# Altium schematic sheet 1S锂电池保护.SchDoc
size A4; SheetNumber: 4; SheetTotal: 7
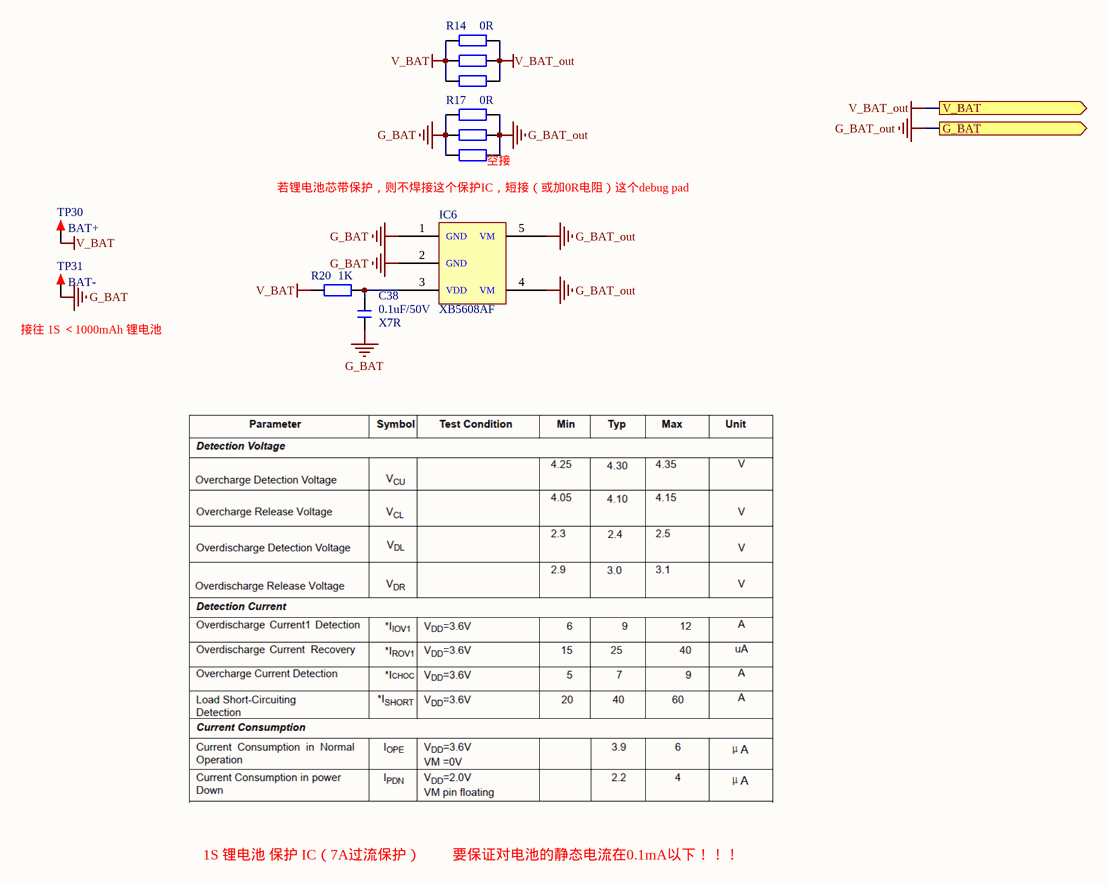
[diagram p0: 1S锂电池保护.SchDoc]

## Parts
C38  0.1uF/50V  BOM名称: X7R  [C 0402_L]
IC6  XB5608AF  [SOT23-5N]
R14  0R  [R 0402_L]
R15  0R  [R 0402_L]  (value not drawn)
R16  0R  [R 0402_L]  (value not drawn)
R17  0R  [R 0402_L]
R18  0R  [R 0402_L]  (value not drawn)
R19  0R  [R 0402_L]  (value not drawn)
R20  1K  [R 0402_L]
TP30  BAT+  [TEST 1.6]
TP31  BAT-  [TEST 1.6]

## Ports
G_BAT (out), V_BAT (out)

## Nets
G_BAT: C38.1 IC6.1 IC6.2 R17.1 R18.1 R19.1 TP31.1
G_BAT_out: IC6.4 IC6.5 R17.2 R18.2 R19.2 ; port G_BAT
V_BAT: R14.1 R15.1 R16.1 R20.1 TP30.1
V_BAT_out: R14.2 R15.2 R16.2 ; port V_BAT
NetC38_2: C38.2 IC6.3 R20.2

## Notes on the sheet
- 若锂电池芯带保护，则不焊接这个保护IC，短接（或加0R电阻）这个debug pad
- (near R19) 空接
- (near IC6) GND
- (near IC6) VM
- (near TP31) 接往 1S ＜1000mAh 锂电池
- (near IC6) VDD
- 1S 锂电池 保护 IC（7A过流保护）
- 要保证对电池的静态电流在0.1mA以下！！！
- Title
- Start date:
- Revision:
- Sheet
- Last date:
- of
- Organization:
- Drawn by:
- Checked by:
- Size:
- A4

## Library data of the parts
C38 = C X7R: 无极性贴片电容 X7R
IC6 = 5: 锂电池 二合一保护IC; BOM名称: 锂电池 二合一保护IC
R14-R20 = R: 贴片电阻 E-96 1%; BOM名称: E-96 1%
TP30 TP31 = TEST: 测试点; 版权归属: 源创客; BOM名称: 测试点; 学习资源: www.ooocke.com